# EAGLE design riksa_control_board (EAGLE 8.6.0)
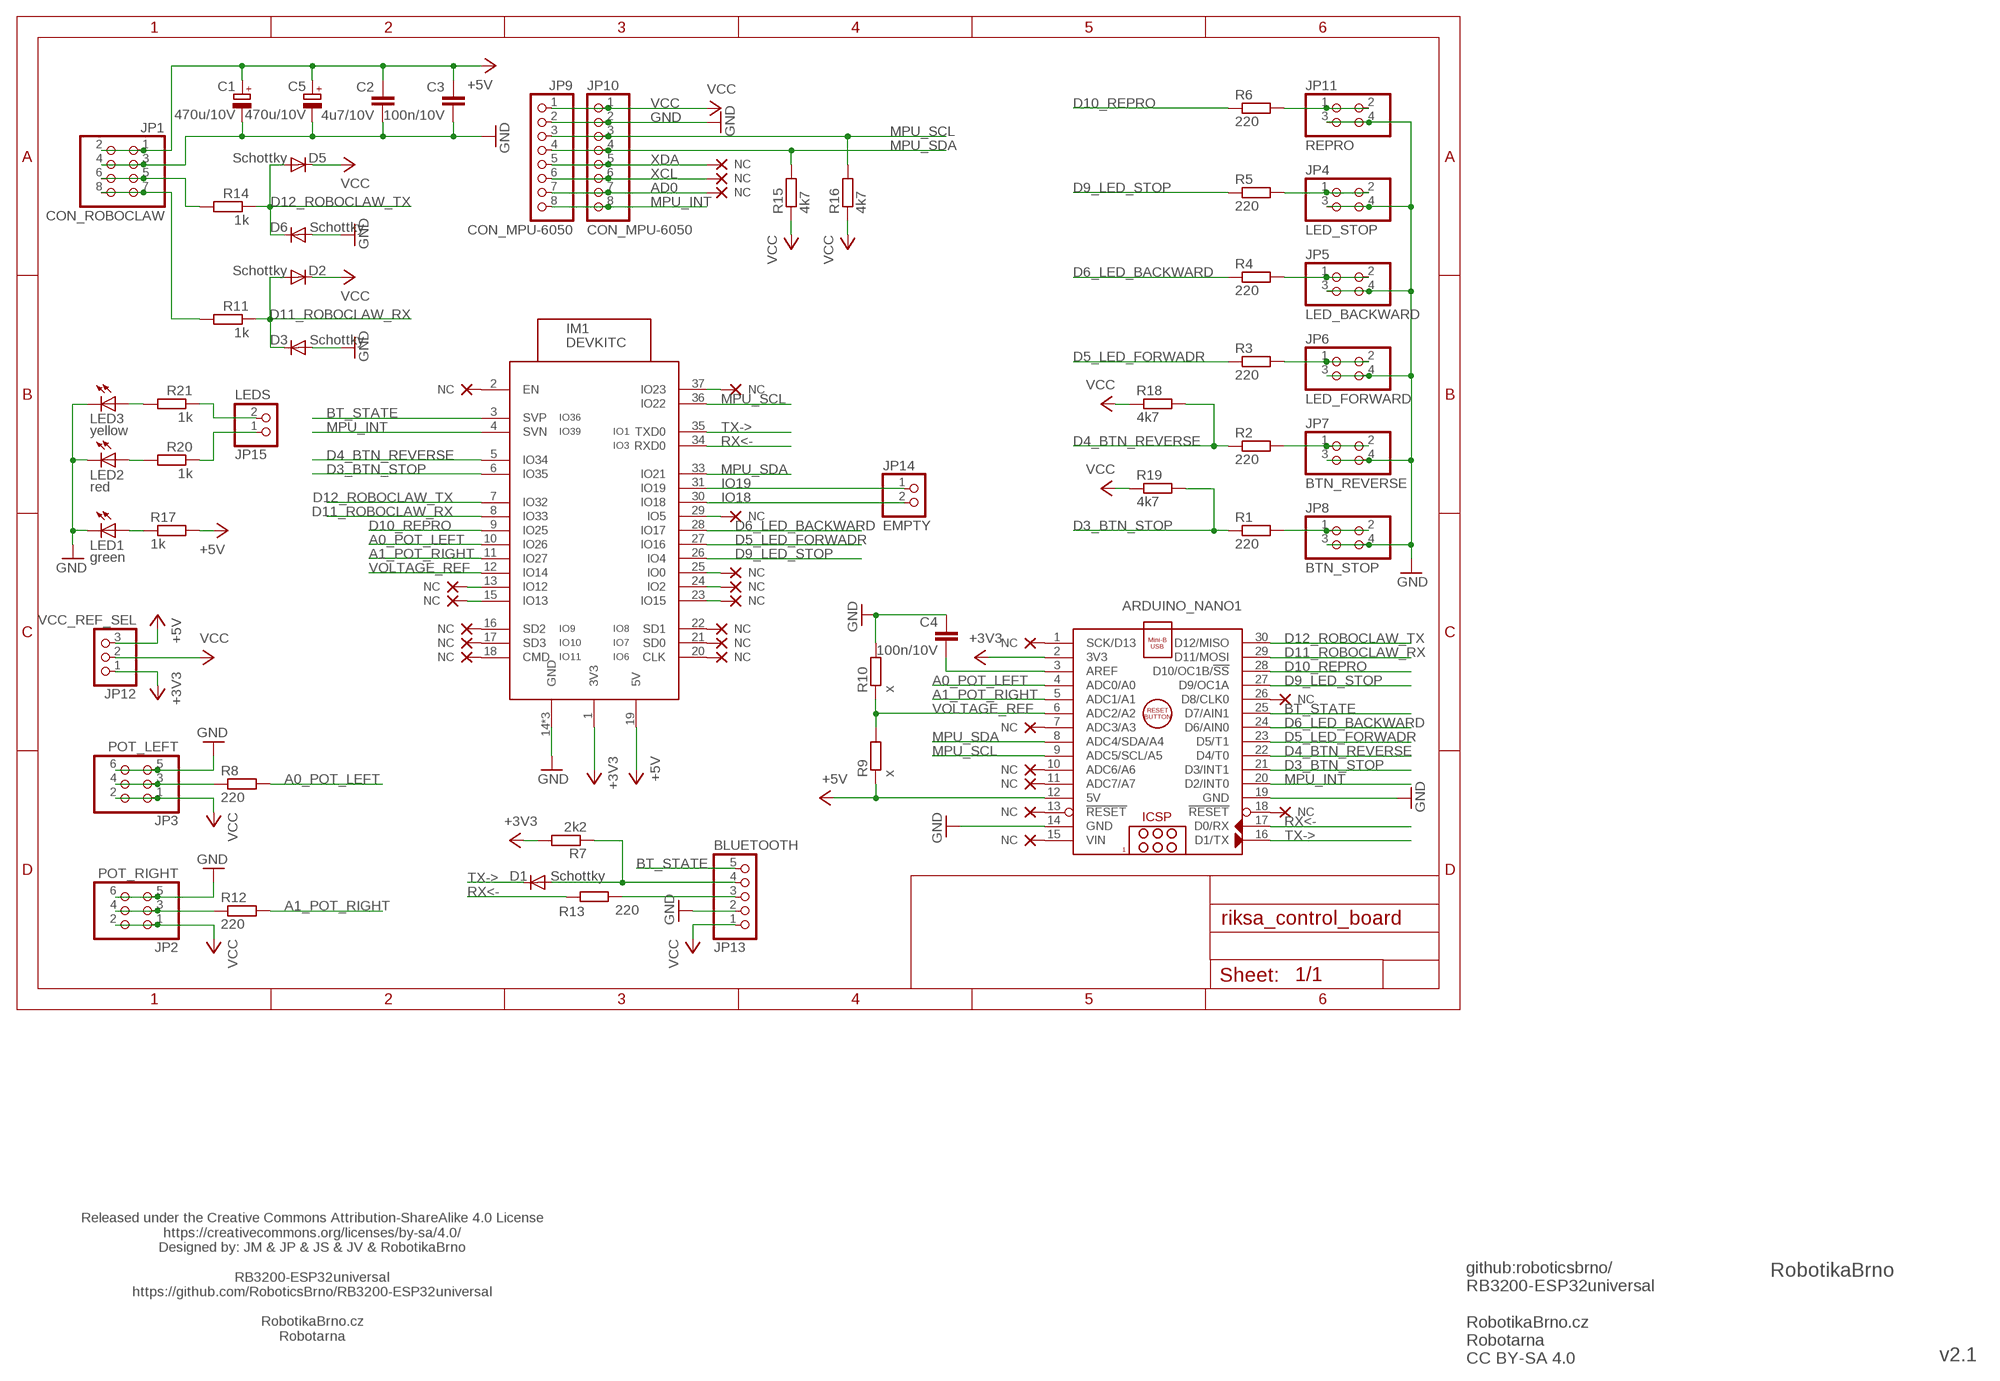
[diagram p0: schematic, sheet 1]

## Parts
ARDUINO_NANO1  ARDUINO_NANO  [ARDUINO_NANO]
C1  470u/10V  CPOL-EUTT6D6  [TT5D6]
C2  4u7/10V  C-EUC0805  [C0805]
C3  100n/10V  C-EUC0603  [C0603]
C4  100n/10V  C-EUC0603  [C0603]
C5  470u/10V  CPOL-EUTT6D6  [TT5D6]
D1  Schottky  DIODE-0603  [D0603]
D2  Schottky  DIODE-0603  [D0603]
D3  Schottky  DIODE-0603  [D0603]
D5  Schottky  DIODE-0603  [D0603]
D6  Schottky  DIODE-0603  [D0603]
IM1  DEVKITC  [DEVKITC]
JP1  CON_ROBOCLAW  PINHD-2X4  [2X04]
JP2  POT_RIGHT  PINHD-2X3  [2X03]
JP3  POT_LEFT  PINHD-2X3  [2X03]
JP4  LED_STOP  PINHD-2X2  [2X02]
JP5  LED_BACKWARD  PINHD-2X2  [2X02]
JP6  LED_FORWARD  PINHD-2X2  [2X02]
JP7  BTN_REVERSE  PINHD-2X2  [2X02]
JP8  BTN_STOP  PINHD-2X2  [2X02]
JP9  CON_MPU-6050  PINHD-1X8  [1X08]
JP10  CON_MPU-6050  PINHD-1X8  [1X08]
JP11  REPRO  PINHD-2X2  [2X02]
JP12  VCC_REF_SEL  PINHD-1X3  [1X03]
JP13  BLUETOOTH  PINHD-1X5/90  [1X05/90]
JP14  EMPTY  PINHD-1X2  [1X02]
JP15  LEDS  PINHD-1X2  [1X02]
LED1  green  LEDCHIPLED_0603  [CHIPLED_0603]
LED2  red  LEDCHIPLED_0603  [CHIPLED_0603]
LED3  yellow  LEDCHIPLED_0603  [CHIPLED_0603]
NC1  NC  (no package)
NC2  NC  (no package)
NC3  NC  (no package)
NC4  NC  (no package)
NC5  NC  (no package)
NC6  NC  (no package)
NC7  NC  (no package)
NC8  NC  (no package)
NC9  NC  (no package)
NC10  NC  (no package)
NC11  NC  (no package)
NC12  NC  (no package)
NC13  NC  (no package)
NC14  NC  (no package)
NC15  NC  (no package)
NC16  NC  (no package)
NC17  NC  (no package)
NC18  NC  (no package)
NC19  NC  (no package)
NC20  NC  (no package)
NC21  NC  (no package)
NC22  NC  (no package)
NC23  NC  (no package)
NC25  NC  (no package)
NC27  NC  (no package)
R1  220  R-EU_R0805  [R0805]
R2  220  R-EU_R0805  [R0805]
R3  220  R-EU_R0805  [R0805]
R4  220  R-EU_R0805  [R0805]
R5  220  R-EU_R0805  [R0805]
R6  220  R-EU_R0805  [R0805]
R7  2k2  R-EU_R0805  [R0805]
R8  220  R-EU_R0805  [R0805]
R9  x  R-EU_R0805  [R0805]
R10  x  R-EU_R0805  [R0805]
R11  1k  R-EU_R0805  [R0805]
R12  220  R-EU_R0805  [R0805]
R13  220  R-EU_R0805  [R0805]
R14  1k  R-EU_R0805  [R0805]
R15  4k7  R-EU_R0805  [R0805]
R16  4k7  R-EU_R0805  [R0805]
R17  1k  R-EU_R0805  [R0805]
R18  4k7  R-EU_R0805  [R0805]
R19  4k7  R-EU_R0805  [R0805]
R20  1k  R-EU_R0805  [R0805]
R21  1k  R-EU_R0805  [R0805]

## Nets
+3V3: ARDUINO_NANO1.2(3V3) IM1.1(3V3) JP12.1 R7.2
+5V: ARDUINO_NANO1.12(5V) C1.+ C2.1 C3.1 C5.+ IM1.19(5V) JP1.1 JP1.2 JP12.3 R9.1 R17.2
A0_POT_LEFT: ARDUINO_NANO1.4(ADC0/A0) IM1.10(IO26) R8.2
A0_POT_LEFT_: JP3.3 JP3.4 R8.1
A1_POT_RIGHT: ARDUINO_NANO1.5(ADC1/A1) IM1.11(IO27) R12.2
A1_POT_RIGHT_: JP2.3 JP2.4 R12.1
AD0: JP9.7 JP10.7 NC1.NC
BT_STATE: ARDUINO_NANO1.25(D7/AIN1) IM1.3(SVP) JP13.5
D3_BTN_STOP: ARDUINO_NANO1.21(D3/INT1) IM1.6(IO35) R1.1 R19.2
D3_BTN_STOP_: JP8.1 JP8.2 R1.2
D4_BTN_REVERSE: ARDUINO_NANO1.22(D4/T0) IM1.5(IO34) R2.1 R18.2
D4_BTN_REVERSE_: JP7.1 JP7.2 R2.2
D5_LED_FORWADR: ARDUINO_NANO1.23(D5/T1) IM1.27(IO16) R3.1
D5_LED_FORWADR_: JP6.1 JP6.2 R3.2
D6_LED_BACKWARD: ARDUINO_NANO1.24(D6/AIN0) IM1.28(IO17) R4.1
D6_LED_BACKWARD_: JP5.1 JP5.2 R4.2
D9_LED_STOP: ARDUINO_NANO1.27(D9/OC1A) IM1.26(IO4) R5.1
D9_LED_STOP_: JP4.1 JP4.2 R5.2
D10_REPRO: ARDUINO_NANO1.28(D10/OC1B/!SS) IM1.9(IO25) R6.1
D10_REPRO_: JP11.1 JP11.2 R6.2
D11_ROBOCLAW_RX: ARDUINO_NANO1.29(D11/MOSI) D2.A D3.C IM1.8(IO33) R11.1
D11_ROBOCLAW_RX_: JP1.7 JP1.8 R11.2
D12_ROBOCLAW_TX: ARDUINO_NANO1.30(D12/MISO) D5.A D6.C IM1.7(IO32) R14.1
D12_ROBOCLAW_TX_: JP1.5 JP1.6 R14.2
GND: ARDUINO_NANO1.14(GND) ARDUINO_NANO1.19(GND) C1.- C2.2 C3.2 C4.1 C5.- D3.A D6.A IM1.14(GND) IM1.32(GND) IM1.38(GND) JP1.3 JP1.4 JP2.5 JP2.6 JP3.5 JP3.6 JP4.3 JP4.4 JP5.3 JP5.4 JP6.3 JP6.4 JP7.3 JP7.4 JP8.3 JP8.4 JP9.2 JP10.2 JP11.3 JP11.4 JP13.2 LED1.C LED2.C LED3.C R10.2
IO18: IM1.30(IO18) JP14.2
IO19: IM1.31(IO19) JP14.1
LED_RED: JP15.1 R20.1
LED_YELLOW: JP15.2 R21.1
MPU_INT: ARDUINO_NANO1.20(D2/INT0) IM1.4(SVN) JP9.8 JP10.8
MPU_SCL: ARDUINO_NANO1.9(ADC5/SCL/A5) IM1.36(IO22) JP9.3 JP10.3 R16.2
MPU_SDA: ARDUINO_NANO1.8(ADC4/SDA/A4) IM1.33(IO21) JP9.4 JP10.4 R15.2
N$1: IM1.22(SD1) NC4.NC
N$2: LED3.A R21.2
N$3: IM1.37(IO23) NC25.NC
N$4: IM1.15(IO13) NC27.NC
N$5: IM1.21(SD0) NC5.NC
N$6: IM1.20(CLK) NC6.NC
N$7: ARDUINO_NANO1.3(AREF) C4.2
N$8: LED2.A R20.2
N$9: IM1.18(CMD) NC7.NC
N$10: IM1.17(SD3) NC9.NC
N$11: LED1.A R17.1
N$12: IM1.16(SD2) NC10.NC
N$13: IM1.2(EN) NC11.NC
N$15: IM1.13(IO12) NC17.NC
N$16: IM1.23(IO15) NC18.NC
N$17: IM1.24(IO2) NC19.NC
N$18: IM1.25(IO0) NC20.NC
N$19: IM1.29(IO5) NC21.NC
N$20: ARDUINO_NANO1.1(SCK/D13) NC8.NC
N$21: ARDUINO_NANO1.7(ADC3/A3) NC12.NC
N$22: ARDUINO_NANO1.10(ADC6/A6) NC13.NC
N$23: ARDUINO_NANO1.11(ADC7/A7) NC14.NC
N$24: ARDUINO_NANO1.18(!RESET) NC15.NC
N$25: ARDUINO_NANO1.26(D8/CLK0) NC16.NC
N$26: ARDUINO_NANO1.13(!RESET) NC22.NC
N$27: ARDUINO_NANO1.15(VIN) NC23.NC
RX<-: ARDUINO_NANO1.17(D0/RX) IM1.34(RXD0) R13.1
RX<-_: JP13.3 R13.2
TX->: ARDUINO_NANO1.16(D1/TX) D1.C IM1.35(TXD0)
TX->_: D1.A JP13.4 R7.1
VCC: D2.C D5.C JP2.1 JP2.2 JP3.1 JP3.2 JP9.1 JP10.1 JP12.2 JP13.1 R15.1 R16.1 R18.1 R19.1
VOLTAGE_REF: ARDUINO_NANO1.6(ADC2/A2) IM1.12(IO14) R9.2 R10.1
XCL: JP9.6 JP10.6 NC2.NC
XDA: JP9.5 JP10.5 NC3.NC

## Notes on the sheet
- Released under the Creative Commons Attribution-ShareAlike 4.0 License
  https://creativecommons.org/licenses/by-sa/4.0/
  Designed by: JM & JP & JS & JV & RobotikaBrno
  
  RB3200-ESP32universal
  https://github.com/RoboticsBrno/RB3200-ESP32universal
  
  RobotikaBrno.cz
  Robotarna
- RobotikaBrno
- v2.1
- github:roboticsbrno/
  RB3200-ESP32universal
  
  RobotikaBrno.cz
  Robotarna
  CC BY-SA 4.0

## Library data of the parts
ARDUINO_NANO1 = ArduinoNanoV30:ARDUINO_NANO: Arduino Nano V3.0 Module Overview: The Arduino Nano is a small, complete, and breadboard-friendly board based on the ATmega328 (Arduino Nano 3.x) or ATmega168 (Arduino Nano 2.x). It has more or less the same functionality of the Arduino Duemilanove, but in a different package. It lacks only a DC power jack, and works with a Mini-B USB cable instead of a standard one. The Nano was designed and is being produced by Gravitech <http://www.gravitech.us/arna30wiatp.html>. General specifications: Item Value Microcontroller Atmel ATmega168 or ATmega328 Operating Voltage (logic level) 5 V Input Voltage (recommended) 7-12 V Input Voltage (limits) 6-20 V Digital I/O Pins 14 (of which 6 provide PWM output) Analog Input Pins 8 DC Current per I/O Pin 40 mA Flash Memory 16 KB (ATmega168) or 32 KB (ATmega328) of which 2 KB used by bootloader SRAM 1 KB (ATmega168) or 2 KB (ATmega328) EEPROM 512 bytes (ATmega168) or 1 KB (ATmega328) Clock Speed 16 MHz Dimensions (Inches) 0.73" x 1.70" Dimensions (mm) 18mm x 45mm Overall height About 9 mm (not including pins) Weigth 5 g Power: The Arduino Nano can be powered via the Mini-B USB connection, 6-20V unregulated external power supply (pin 30), or 5V regulated external power supply (pin 27). The power source is automatically selected to the highest voltage source. Memory: The ATmega168 has 16 KB of flash memory for storing code (of which 2 KB is used for the bootloader); the ATmega328 has 32 KB, (also with 2 KB used for the bootloader). The ATmega168 has 1 KB of SRAM and 512 bytes of EEPROM (which can be read and written with the EEPROM library); the ATmega328 has 2 KB of SRAM and 1 KB of EEPROM. Input and Output: Each of the 14 digital pins on the Nano can be used as an input or output, using pinMode(), digitalWrite(), and digitalRead() functions. They operate at 5 volts. Each pin can provide or receive a maximum of 40 mA and has an internal pull-up resistor (disconnected by default) of 20-50 kOhms. In addition, some pins have specialized functions. Visit Arduino - ArduinoBoardNano <https://www.arduino.cc/en/Main/ArduinoBoardNano>
C1 C5 = rcl:CPOL-EU: POLARIZED CAPACITOR, European symbol; SPICEPREFIX: C
C2-C4 = rcl:C-EU: CAPACITOR, European symbol; SPICEPREFIX: C
D1-D3 D5 D6 = diode:DIODE: DIODE ultra fast-recovery rectifier
IM1 = esp32:DEVKITC
JP1 = pinhead:PINHD-2X4: PIN HEADER
JP2 JP3 = pinhead:PINHD-2X3: PIN HEADER
JP4-JP8 JP11 = pinhead:PINHD-2X2: PIN HEADER
JP9 JP10 = pinhead:PINHD-1X8: PIN HEADER
JP12 = pinhead:PINHD-1X3: PIN HEADER
JP13 = pinhead:PINHD-1X5: PIN HEADER
JP14 JP15 = pinhead:PINHD-1X2: PIN HEADER
LED1-LED3 = led:LED: LED OSRAM: - CHIPLED LG R971, LG N971, LY N971, LG Q971, LY Q971, LO R971, LY R971 LH N974, LH R974 LS Q976, LO Q976, LY Q976 LO Q996 - Hyper CHIPLED LW Q18S LB Q993, LB Q99A, LB R99A - SideLED LS A670, LO A670, LY A670, LG A670, LP A670 LB A673, LV A673, LT A673, LW A673 LH A674 LY A675 LS A676, LA A676, LO A676, LY A676, LW A676 LS A679, LY A679, LG A679 - Hyper Micro SIDELED® LS Y876, LA Y876, LO Y876, LY Y876 LT Y87S - SmartLED LW L88C, LW L88S LB L89C, LB L89S, LG L890 LS L89K, LO L89K, LY L89K LS L896, LA L896, LO L896, LY L896 - TOPLED LS T670, LO T670, LY T670, LG T670, LP T670 LSG T670, LSP T670, LSY T670, LOP T670, LYG T670 LG T671, LOG T671, LSG T671 LB T673, LV T673, LT T673, LW T673 LH T674 LS T676, LA T676, LO T676, LY T676, LB T676, LH T676, LSB T676, LW T676 LB T67C, LV T67C, LT T67C, LS T67K, LO T67K, LY T67K, LW E67C LS E67B, LA E67B, LO E67B, LY E67B, LB E67C, LV E67C, LT E67C LW T67C LS T679, LY T679, LG T679 LS T770, LO T770, LY T770, LG T770, LP T770 LB T773, LV T773, LT T773, LW T773 LH T774 LS E675, LA E675, LY E675, LS T675 LS T776, LA T776, LO T776, LY T776, LB T776 LHGB T686 LT T68C, LB T68C - Hyper Mini TOPLED® LB M676 - Mini TOPLED Santana® LG M470 LS M47K, LO M47K, LY M47K Source: http://www.osram.convergy.de LUXEON: - LUMILED® LXK2-PW12-R00, LXK2-PW12-S00, LXK2-PW14-U00, LXK2-PW14-V00 LXK2-PM12-R00, LXK2-PM12-S00, LXK2-PM14-U00 LXK2-PE12-Q00, LXK2-PE12-R00, LXK2-PE12-S00, LXK2-PE14-T00, LXK2-PE14-U00 LXK2-PB12-K00, LXK2-PB12-L00, LXK2-PB12-M00, LXK2-PB14-N00, LXK2-PB14-P00, LXK2-PB14-Q00 LXK2-PR12-L00, LXK2-PR12-M00, LXK2-PR14-Q00, LXK2-PR14-R00 LXK2-PD12-Q00, LXK2-PD12-R00, LXK2-PD12-S00 LXK2-PH12-R00, LXK2-PH12-S00 LXK2-PL12-P00, LXK2-PL12-Q00, LXK2-PL12-R00 Source: www.luxeon.com KINGBRIGHT: KA-3528ASYC Source: www.kingbright.com
NC1-NC23 NC25 NC27 = NC:NC: _EXTERNAL_
R1-R21 = rcl:R-EU_: RESISTOR, European symbol

## Board
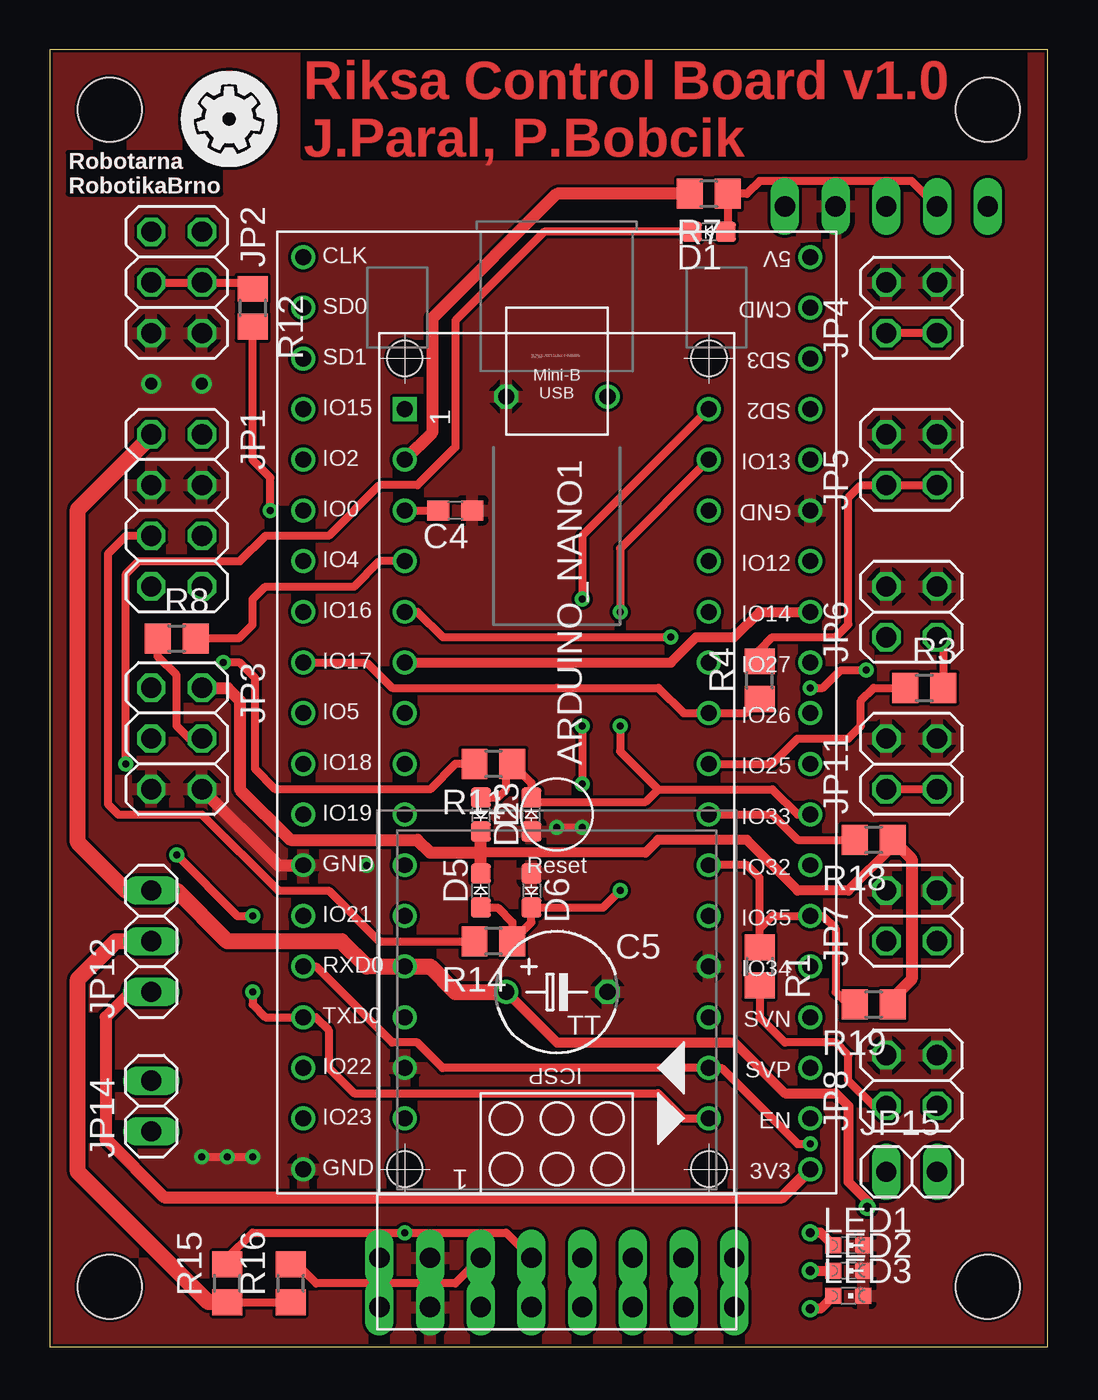
[diagram p1: board, top side]
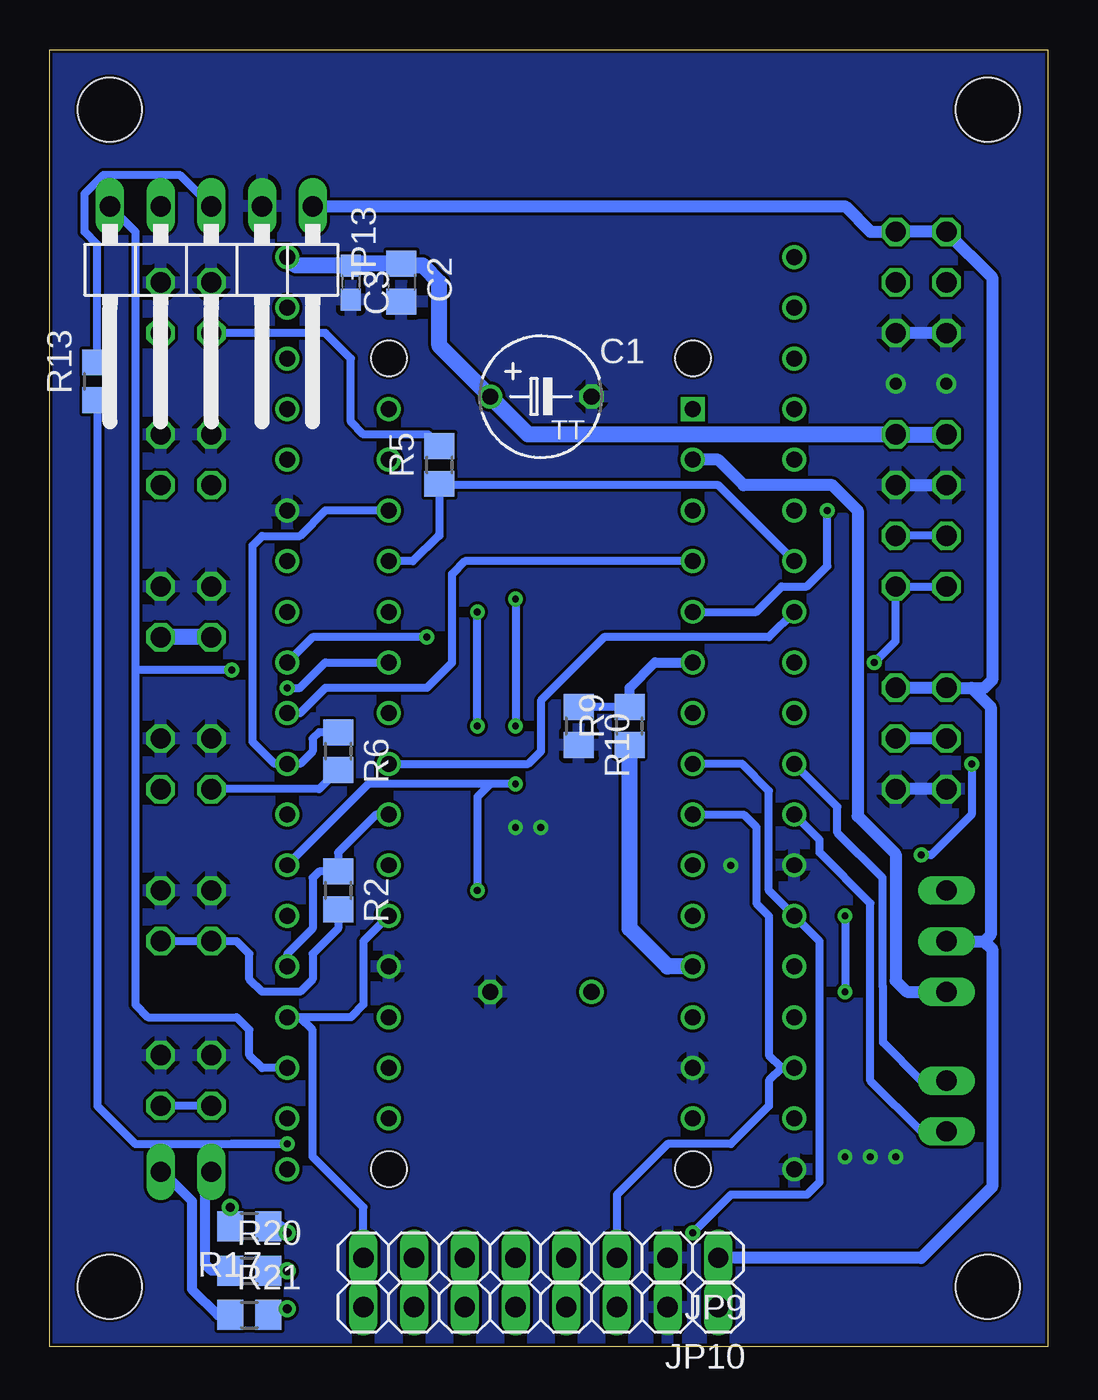
[diagram p2: board, bottom side, seen from below]

Size 50 x 65 mm. Coordinates in mm from the lower left corner, seen from the top.
Outline: 0,0 50,0 50,65 0,65 0,0
Copper layers (1*16): Top 0.035mm / dielectric 1.5mm / Bottom 0.035mm
Design rules "gatema_2layers": minimum track width 0.15mm, minimum drill 0.3mm, track to track 0.15mm, track to pad 0.15mm, pad to pad 0.15mm, via to via 0.15mm, smd to smd 0mil, copper to edge 0.15mm, drill to drill 0.4mm, minimum pad ring 0.2mm, minimum via ring 0.2mm, stop-mask expansion 2mil, vias tented up to drill 0.4mm, thermal gap 10mil
Holes 3.2 mm at 3,3 47,3 3,62 47,62

### Footprints (pad centres in the part's own frame; a part is rotated, then mirrored left to right if it is on the bottom)
ARDUINO_NANO = drill 0.8 square: 1 -20.32,-7.62 | drill 0.8: 2 -17.78,-7.62; 3 -15.24,-7.62; 4 -12.7,-7.62; 5 -10.16,-7.62; 6 -7.62,-7.62; 7 -5.08,-7.62; 8 -2.54,-7.62; 9 0,-7.62; 10 2.54,-7.62; 11 5.08,-7.62; 12 7.62,-7.62; 13 10.16,-7.62; 14 12.7,-7.62; 15 15.24,-7.62; 16 15.24,7.62; 17 12.7,7.62; 18 10.16,7.62; 19 7.62,7.62; 20 5.08,7.62; 21 2.54,7.62; 22 0,7.62; 23 -2.54,7.62; 24 -5.08,7.62; 25 -7.62,7.62; 26 -10.16,7.62; 27 -12.7,7.62; 28 -15.24,7.62; 29 -17.78,7.62; 30 -20.32,7.62 | hole 1.778: -22.86,-7.62; -22.86,7.62; 17.78,7.62; 17.78,-7.62
TT5D6 = drill 0.813: + -2.54,0 | drill 0.813 octagon: - 2.54,0
C0805 = smd 1.3 x 1.5: 1 -0.95,0; 2 0.95,0
C0603 = smd 1.1 x 1: 1 -0.85,0; 2 0.85,0
D0603 = smd 1 x 1: A -0.85,0; C 0.85,0
DEVKITC = drill 0.8: 1 -12.7,46.99; 2 -12.7,44.45; 3 -12.7,41.91; 4 -12.7,39.37; 5 -12.7,36.83; 6 -12.7,34.29; 7 -12.7,31.75; 8 -12.7,29.21; 9 -12.7,26.67; 10 -12.7,24.13; 11 -12.7,21.59; 12 -12.7,19.05; 13 -12.7,16.51; 14 -12.7,13.97; 15 -12.7,11.43; 16 -12.7,8.89; 17 -12.7,6.35; 18 -12.7,3.81; 19 -12.7,1.27; 20 12.7,1.27; 21 12.7,3.81; 22 12.7,6.35; 23 12.7,8.89; 24 12.7,11.43; 25 12.7,13.97; 26 12.7,16.51; 27 12.7,19.05; 28 12.7,21.59; 29 12.7,24.13; 30 12.7,26.67; 31 12.7,29.21; 32 12.7,31.75; 33 12.7,34.29; 34 12.7,36.83; 35 12.7,39.37; 36 12.7,41.91; 37 12.7,44.45; 38 12.7,46.99
2X04 = drill 1.016 octagon: 1 -3.81,-1.27; 2 -3.81,1.27; 3 -1.27,-1.27; 4 -1.27,1.27; 5 1.27,-1.27; 6 1.27,1.27; 7 3.81,-1.27; 8 3.81,1.27
2X03 = drill 1.016 octagon: 1 -2.54,-1.27; 2 -2.54,1.27; 3 0,-1.27; 4 0,1.27; 5 2.54,-1.27; 6 2.54,1.27
2X02 = drill 1.016 octagon: 1 -1.27,-1.27; 2 -1.27,1.27; 3 1.27,-1.27; 4 1.27,1.27
1X08 = drill 1.016 long: 1 -8.89,0; 2 -6.35,0; 3 -3.81,0; 4 -1.27,0; 5 1.27,0; 6 3.81,0; 7 6.35,0; 8 8.89,0
1X03 = drill 1.016 long: 1 -2.54,0; 2 0,0; 3 2.54,0
1X05/90 = drill 1.016 long: 1 -5.08,-3.81; 2 -2.54,-3.81; 3 0,-3.81; 4 2.54,-3.81; 5 5.08,-3.81
1X02 = drill 1.016 long: 1 -1.27,0; 2 1.27,0
CHIPLED_0603 = smd 0.8 x 0.8: A 0,-0.75; C 0,0.75
R0805 = smd 1.3 x 1.5: 1 -0.95,0; 2 0.95,0

### Placement (x,y rotation side)
ARDUINO_NANO1  25.4,26.67 270 top
C1  25.4,47.62 0 bottom
C2  32.38,53.34 270 bottom
C3  34.92,53.34 270 bottom
C4  20.32,41.91 180 top
C5  25.4,17.78 0 top
D1  33.02,55.88 180 top
D2  21.59,26.67 270 top
D3  24.13,26.67 90 top
D5  21.59,22.86 90 top
D6  24.13,22.86 270 top
IM1  25.4,55.88 180 top
JP1  6.35,41.91 270 top
JP2  6.35,53.34 270 top
JP3  6.35,30.48 270 top
JP4  43.18,52.07 90 top
JP5  43.18,44.45 90 top
JP6  43.18,36.83 90 top
JP7  43.18,21.59 90 top
JP8  43.18,13.34 90 top
JP9  25.4,4.45 180 bottom
JP10  25.4,1.99 180 bottom
JP11  43.18,29.21 90 top
JP12  5.08,20.32 90 top
JP13  41.91,53.34 180 bottom
JP14  5.08,12.06 90 top
JP15  43.18,8.76 0 top
LED1  40.01,5.08 270 top
LED2  40.01,3.81 270 top
LED3  40.01,2.54 270 top
R1  35.56,19.05 270 top
R2  35.56,22.86 270 bottom
R3  43.81,33.02 0 top
R4  35.56,33.4 90 top
R5  30.48,44.2 90 bottom
R6  35.56,29.84 270 bottom
R7  33.02,57.78 180 top
R8  6.35,35.5 0 top
R9  20.95,31.12 90 bottom
R10  23.5,31.12 270 bottom
R11  22.23,29.21 180 top
R12  10.16,52.07 270 top
R13  47.62,48.39 90 bottom
R14  22.23,20.32 180 top
R15  8.89,3.17 90 top
R16  12.06,3.17 90 top
R17  40.01,6.03 180 bottom
R18  41.27,25.4 180 top
R19  41.27,17.14 180 top
R20  40.01,3.81 0 bottom
R21  40.01,1.59 0 bottom

### Tracks (layer width: path | path; a pad name or v marks a point on that pad's centre or on a via)
+3V3
  Top 0.61: R7.2 25.4,57.78 19.18,51.56 19.18,45.85 ARDUINO_NANO1.2 | IM1.1 36.7,7.49 5.71,7.49 2.79,10.41 2.79,16.51 4.07,17.78 JP12.1
  Bottom 0.61: ARDUINO_NANO1.2 16.51,44.45 15.24,43.18 10.8,43.18 10.79,43.18 9.53,41.91 9.53,26.59 7.62,24.69 7.62,18.34 7.07,17.78 JP12.1
+5V  (via drill 0.45)
  Top 0.508: C5.+ 25.4,15.24 34.29,15.24 36.83,12.7 39.37,12.7 40.01,12.06 40.01,8.26 41.02,7.24 40.96,7.18 v40.96,6.99
  Top 0.813: JP1.1 5.08,45.64 1.4,41.96 1.4,25.28 3.81,22.86 JP12.3 6.35,22.86 8.89,20.32 14.61,20.32 15.88,19.05 16.51,19.05 ARDUINO_NANO1.12 19.05,19.05 20.32,17.78 C5.+
  Bottom 0.508: v40.96,6.99 R17.2
  Bottom 0.61: 32.48,54.19 C2.1
  Bottom 0.813: JP1.1 JP1.2 26.04,45.72 C1.+ 30.48,50.16 30.48,53.34 31.33,54.19 32.48,54.19 | R9.1 20.95,20.96 19.05,19.05 ARDUINO_NANO1.12 | C2.1 34.83,54.29 C3.1 37.68,54.19 IM1.19
A0_POT_LEFT
  Top 0.406: ARDUINO_NANO1.4 16.51,39.37 15.24,38.1 10.79,38.1 10.16,37.47 10.16,36.2 9.46,35.5 R8.2 | ARDUINO_NANO1.4 | ARDUINO_NANO1.4
  Bottom 0.406: IM1.10 37.47,31.75 36.2,33.02 31.11,33.02 29.84,34.29 29.84,38.73 29.21,39.37 ARDUINO_NANO1.4
A0_POT_LEFT_
  Top 0.406: JP3.4 6.98,30.48 6.35,31.11 6.35,33.66 5.4,34.6 R8.1
  Bottom 0.61: JP3.3 JP3.4
A1_POT_RIGHT  (via drill 0.35)
  Top 0.406: v11.05,41.91 11.05,43.56 10.16,44.45 R12.2 | ARDUINO_NANO1.5 18.41,36.83 19.68,35.56 v31.11,35.56
  Bottom 0.406: v11.05,41.91 11.05,39.12 12.06,38.1 13.33,38.1 14.6,36.83 ARDUINO_NANO1.5 | IM1.11 36.83,35.56 v31.11,35.56
A1_POT_RIGHT_
  Top 0.406: JP2.3 JP2.4 9.84,53.34 R12.1
AD0
  Top 0.406: JP9.7 JP10.7
BT_STATE  (via drill 0.35)
  Top 0.406: v40.89,33.91 39.63,33.91 38.73,33.02 v38.1,33.02
  Bottom 0.406: IM1.3 39.37,13.97 40.01,14.61 40.01,15.88 40.64,16.51 45.09,16.51 45.72,17.15 45.72,33.97 | ARDUINO_NANO1.25 36.2,34.29 37.47,33.02 v38.1,33.02 | JP13.5 45.72,55.88 45.72,33.97 | v40.89,33.91 45.66,33.91 45.72,33.97
D3_BTN_STOP
  Top 0.406: R1.1 35.56,20.96 | 35.56,20.96 36.2,21.59 IM1.6 38.73,21.59 39.37,20.95 39.37,17.78 40.01,17.14 R19.2 | ARDUINO_NANO1.21 34.92,24.13 35.56,23.5 35.56,20.96
D3_BTN_STOP_
  Top 0.406: R1.2 35.56,16.51 36.83,15.24 39.37,15.24 40.01,14.61 40.01,13.34 41.27,12.06 JP8.2
  Bottom 0.406: JP8.2 JP8.1
D4_BTN_REVERSE
  Top 0.406: ARDUINO_NANO1.22 36.2,26.67 37.47,25.4 R18.2
  Bottom 0.406: 38.1,19.68 IM1.5 38.1,19.69 36.83,20.96 36.83,23.5 36.52,23.81 R2.1 35.56,24.77 33.66,26.67 ARDUINO_NANO1.22
D4_BTN_REVERSE_
  Bottom 0.406: JP7.1 JP7.2 40.64,20.32 40.01,19.69 40.01,18.42 39.37,17.78 37.47,17.78 36.83,18.42 36.83,19.69 35.56,20.96 R2.2
D5_LED_FORWADR
  Top 0.406: ARDUINO_NANO1.23 36.2,29.21 37.47,30.48 40.01,30.48 40.64,31.11 40.64,32.38 41.27,33.02 R3.1
  Bottom 0.406: IM1.27 13.97,35.56 22.23,35.56 25.4,32.38 25.4,31.75 25.4,29.84 26.04,29.21 ARDUINO_NANO1.23
D5_LED_FORWADR_
  Top 0.406: JP6.1 44.77,35.25 R3.2
  Bottom 0.813: JP6.2 JP6.1
D6_LED_BACKWARD
  Top 0.406: R4.1 34.86,31.75 ARDUINO_NANO1.24 32.39,31.75 | 32.39,31.75 32.38,31.75 | 32.39,31.75 31.75,31.75 30.49,33.02 25.4,33.02 17.14,33.02 15.88,34.29 IM1.28
D6_LED_BACKWARD_
  Top 0.406: JP5.1 JP5.2 40.64,43.18 40.01,42.55 40.01,36.2 39.37,35.56 36.2,35.56 35.56,34.93 R4.2
D9_LED_STOP
  Bottom 0.406: ARDUINO_NANO1.27 31.82,39.37 30.55,40.64 30.48,40.64 R5.1 30.41,43.18 16.51,43.18 IM1.26
D9_LED_STOP_
  Top 0.406: JP4.1 JP4.2
  Bottom 0.406: JP4.2 36.2,50.8 34.92,49.53 34.92,46.36 34.29,45.72 31.05,45.72 R5.2
D10_REPRO
  Bottom 0.406: ARDUINO_NANO1.28 33.66,41.91 36.2,41.91 37.47,40.64 39.37,40.64 39.84,40.17 39.84,30.32 38.73,29.21 IM1.9 | IM1.9 | IM1.9 37.47,29.21 36.83,29.84 36.83,30.48 36.52,30.8 R6.1
D10_REPRO_
  Top 0.406: JP11.2 JP11.1
  Bottom 0.406: R6.2 36.51,27.94 JP11.2
D11_ROBOCLAW_RX  (via drill 0.35)
  Top 0.406: ARDUINO_NANO1.29 28.57,40.01 v28.57,36.83 | v28.57,31.11 28.57,29.84 30.48,27.94 | 30.48,27.94 29.84,27.3 24.34,27.3 D3.C 24.13,28.25 R11.1 23.18,28.89 22.86,28.57 22.86,27.94 22.44,27.52 D2.A | IM1.8 37.47,26.67 36.2,27.94 30.48,27.94
  Bottom 0.406: v28.57,31.11 v28.57,36.83
D11_ROBOCLAW_RX_  (via drill 0.35)
  Top 0.406: R11.2 20.32,29.21 19.05,27.94 11.3,27.94 10.29,28.96 10.29,33.53 9.53,34.29 v8.7,34.29
  Bottom 0.406: JP1.7 JP1.8 7.62,35.37 v8.7,34.29
D12_ROBOCLAW_TX  (via drill 0.35)
  Top 0.406: ARDUINO_NANO1.30 26.67,40.64 v26.67,37.47 | v26.67,31.11 v26.67,28.19 | v28.57,22.86 27.73,22.01 D6.C 24.13,21.27 R14.1 23.18,21.27 22.44,22.01 D5.A
  Bottom 0.406: IM1.7 34.04,28.19 27.94,28.19 | v26.67,37.47 v26.67,31.11 | v26.67,28.19 27.94,28.19 | 27.94,28.19 28.57,27.56 v28.57,22.86
D12_ROBOCLAW_TX_
  Top 0.406: 21.59,20.32 R14.2 16.51,20.32 13.97,22.86 11.43,22.86 7.62,26.67 3.43,26.67 2.92,27.18 2.92,39.75 3.81,40.64 JP1.5
  Bottom 0.406: JP1.5 JP1.6
GND  (via drill 0.35, 0.6)
  Top 0.406: v25.4,26.04 v26.67,26.04 | v7.62,9.53 v8.89,9.53 v10.16,9.53
  Top 0.61: JP3.6 11.43,24.13 IM1.32
  Bottom 0.61: JP2.5 JP2.6 | JP3.5 JP3.6 | JP1.4 JP1.3
  other vias: 5.08,48.26 7.62,48.26 15.88,24.13
  pour Bottom: 0,65 0,0 49.98,0 50,65
  pour Top: 0,65.41 50.16,65.41 50.16,0 0,0
IO18
  Bottom 0.406: IM1.30 10.54,27.05 10.54,25.76 8.28,23.5 8.28,18.07 8.26,18.04 8.26,15.24 6.35,13.34 JP14.2
IO19
  Bottom 0.406: IM1.31 11.43,25.4 11.43,24.77 8.89,22.23 8.89,13.34 6.35,10.79 JP14.1
LED_RED
  Bottom 0.508: R20.1 41.91,3.81 42.23,4.13 42.23,8.45 JP15.1
LED_YELLOW
  Bottom 0.508: JP15.2 44.35,8.76 42.89,7.3 42.89,2.88 41.59,1.59 R21.1
MPU_INT
  Top 0.406: JP9.8 JP10.8
  Bottom 0.406: JP9.8 34.29,6.99 36.83,9.53 36.83,15.88 37.47,16.51 IM1.4 34.93,16.51 34.92,16.51 34.29,17.14 34.29,20.32 ARDUINO_NANO1.20
MPU_SCL
  Top 0.406: JP10.3 JP9.3 20.32,3.17 13.34,3.17 12.38,4.12 R16.2
  Bottom 0.406: ARDUINO_NANO1.9 15.24,26.67 14.61,26.04 14.61,22.86 14.61,22.23 13.97,21.59 13.97,14.61 13.34,13.97 | 13.34,13.97 | 13.34,13.97 | 13.34,13.97 IM1.36 13.34,13.97 | 13.34,13.97 13.97,13.34 13.97,12.06 15.88,10.16 19.05,10.16 21.59,7.62 JP9.3
MPU_SDA  (via drill 0.35)
  Top 0.406: JP10.4 JP9.4 22.86,5.71 v17.78,5.71 10.16,5.71 8.89,4.45 R15.2
  Bottom 0.406: IM1.33 13.97,22.86 13.97,27.86 15.32,29.21 ARDUINO_NANO1.8 | IM1.33 | IM1.33 11.43,20.32 11.43,8.26 12.06,7.62 15.88,7.62 v17.78,5.71
N$2  (via drill 0.45)
  Top 0.508: LED3.A 38.62,1.91 v38.1,1.91
  Bottom 0.508: v38.1,1.91 38.74,1.91 R21.2
N$7
  Top 0.406: ARDUINO_NANO1.3 C4.2
N$8  (via drill 0.45)
  Top 0.508: v38.1,3.81 LED2.A
  Bottom 0.508: R20.2 v38.1,3.81
N$11  (via drill 0.45)
  Top 0.508: LED1.A 38.62,5.71 v38.1,5.71
  Bottom 0.508: v38.1,5.71 38.42,6.03 R17.1
RX<-  (via drill 0.35)
  Top 0.406: ARDUINO_NANO1.17 33.66,13.97 37.47,10.16 v38.1,10.16 | ARDUINO_NANO1.17 | IM1.34 13.34,19.05 17.14,15.24 18.41,15.24 19.68,13.97 ARDUINO_NANO1.17
  Bottom 0.406: 40.94,10.16 v38.1,10.16 45.72,10.16 47.62,12.06 R13.1
RX<-_
  Bottom 0.406: JP13.3 43.5,58.74 47.31,58.74 48.26,57.78 48.26,55.88 47.62,55.24 R13.2
TX->  (via drill 0.35)
  Top 0.406: D1.C 24.77,55.88 20.32,51.44 20.32,45.09 18.41,43.18 16.51,43.18 13.97,40.64 10.79,40.64 9.53,39.37 4.45,39.37 3.81,38.73 v3.81,29.21 | v10.16,17.78 10.16,17.14 10.79,16.51 10.8,16.51 IM1.35 13.33,16.51 13.97,15.88 13.97,13.97 15.24,12.7 30.48,12.7 31.75,11.43 ARDUINO_NANO1.16 | v6.35,24.64 9.4,21.59 v10.16,21.59
  Bottom 0.406: v10.16,21.59 v10.16,17.78 | v3.81,29.21 3.81,26.67 5.84,24.64 v6.35,24.64
TX->_
  Top 0.406: JP13.4 43.18,58.42 35.56,58.42 34.92,57.78 R7.1 33.97,55.98 D1.A
VCC
  Top 0.406: R15.1 R16.1
  Top 0.508: R18.1 42.23,25.08 40.01,22.86 37.47,22.86 34.92,25.4 30.48,25.4 29.84,24.77 21.59,24.77
  Top 0.61: JP3.2 8.89,33.02 9.53,32.38 9.53,27.94 12.06,25.4 18.41,25.4 19.05,24.77 21.59,24.77 | D5.C 21.59,24.77 | 21.59,24.77 D2.C | R18.1 43.18,24.45 43.18,18.41 42.23,17.46 R19.1
  Top 0.813: JP12.2 3.3,20.32 1.4,18.41 1.4,8.76 7.93,2.23 R15.1
  Bottom 0.61: JP3.2 JP3.1 3.81,33.02 | JP10.1 JP9.1 6.35,4.45 2.79,8 2.79,19.94 3.17,20.32 | JP12.2 3.17,20.32 | 3.17,20.32 2.86,20.64 2.86,32.07 3.81,33.02 | 3.81,33.02 3.17,33.02 2.79,33.41 2.79,53.6 JP2.1 JP2.2 8.89,55.88 10.16,57.15 JP13.1
VOLTAGE_REF
  Top 0.508: IM1.12 35.56,36.83 34.29,35.56 32.38,35.56 31.11,34.29 ARDUINO_NANO1.6
  Bottom 0.406: R9.2 R10.1
  Bottom 0.508: R9.2 20.95,33.02 19.68,34.29 ARDUINO_NANO1.6
XCL
  Top 0.406: JP9.6 JP10.6
XDA
  Top 0.406: JP9.5 JP10.5
(copper drawn outside any net)
  shapes: Top area x1377

### Text on the board
Top: Riksa Control Board v1.0 / J.Paral, P.Bobcik | Robotarna / RobotikaBrno
tPlace: Robotarna / RobotikaBrno
tDocu: Riksa Control Board v1.0 / J.Paral, P.Bobcik / CC BY-SA 4.0 | + | - | RX | TX | ST | + | S | P_R | - | L_S | + | - | - | L_B | TX | RX | - | ROBOCLAW | L_F | + | S | - | P_L | - | REP | 5V | - | B_REV | VCC_REF | 3V3 | - | 18 | B_ST | IO:19 | LED | VCC | MPU